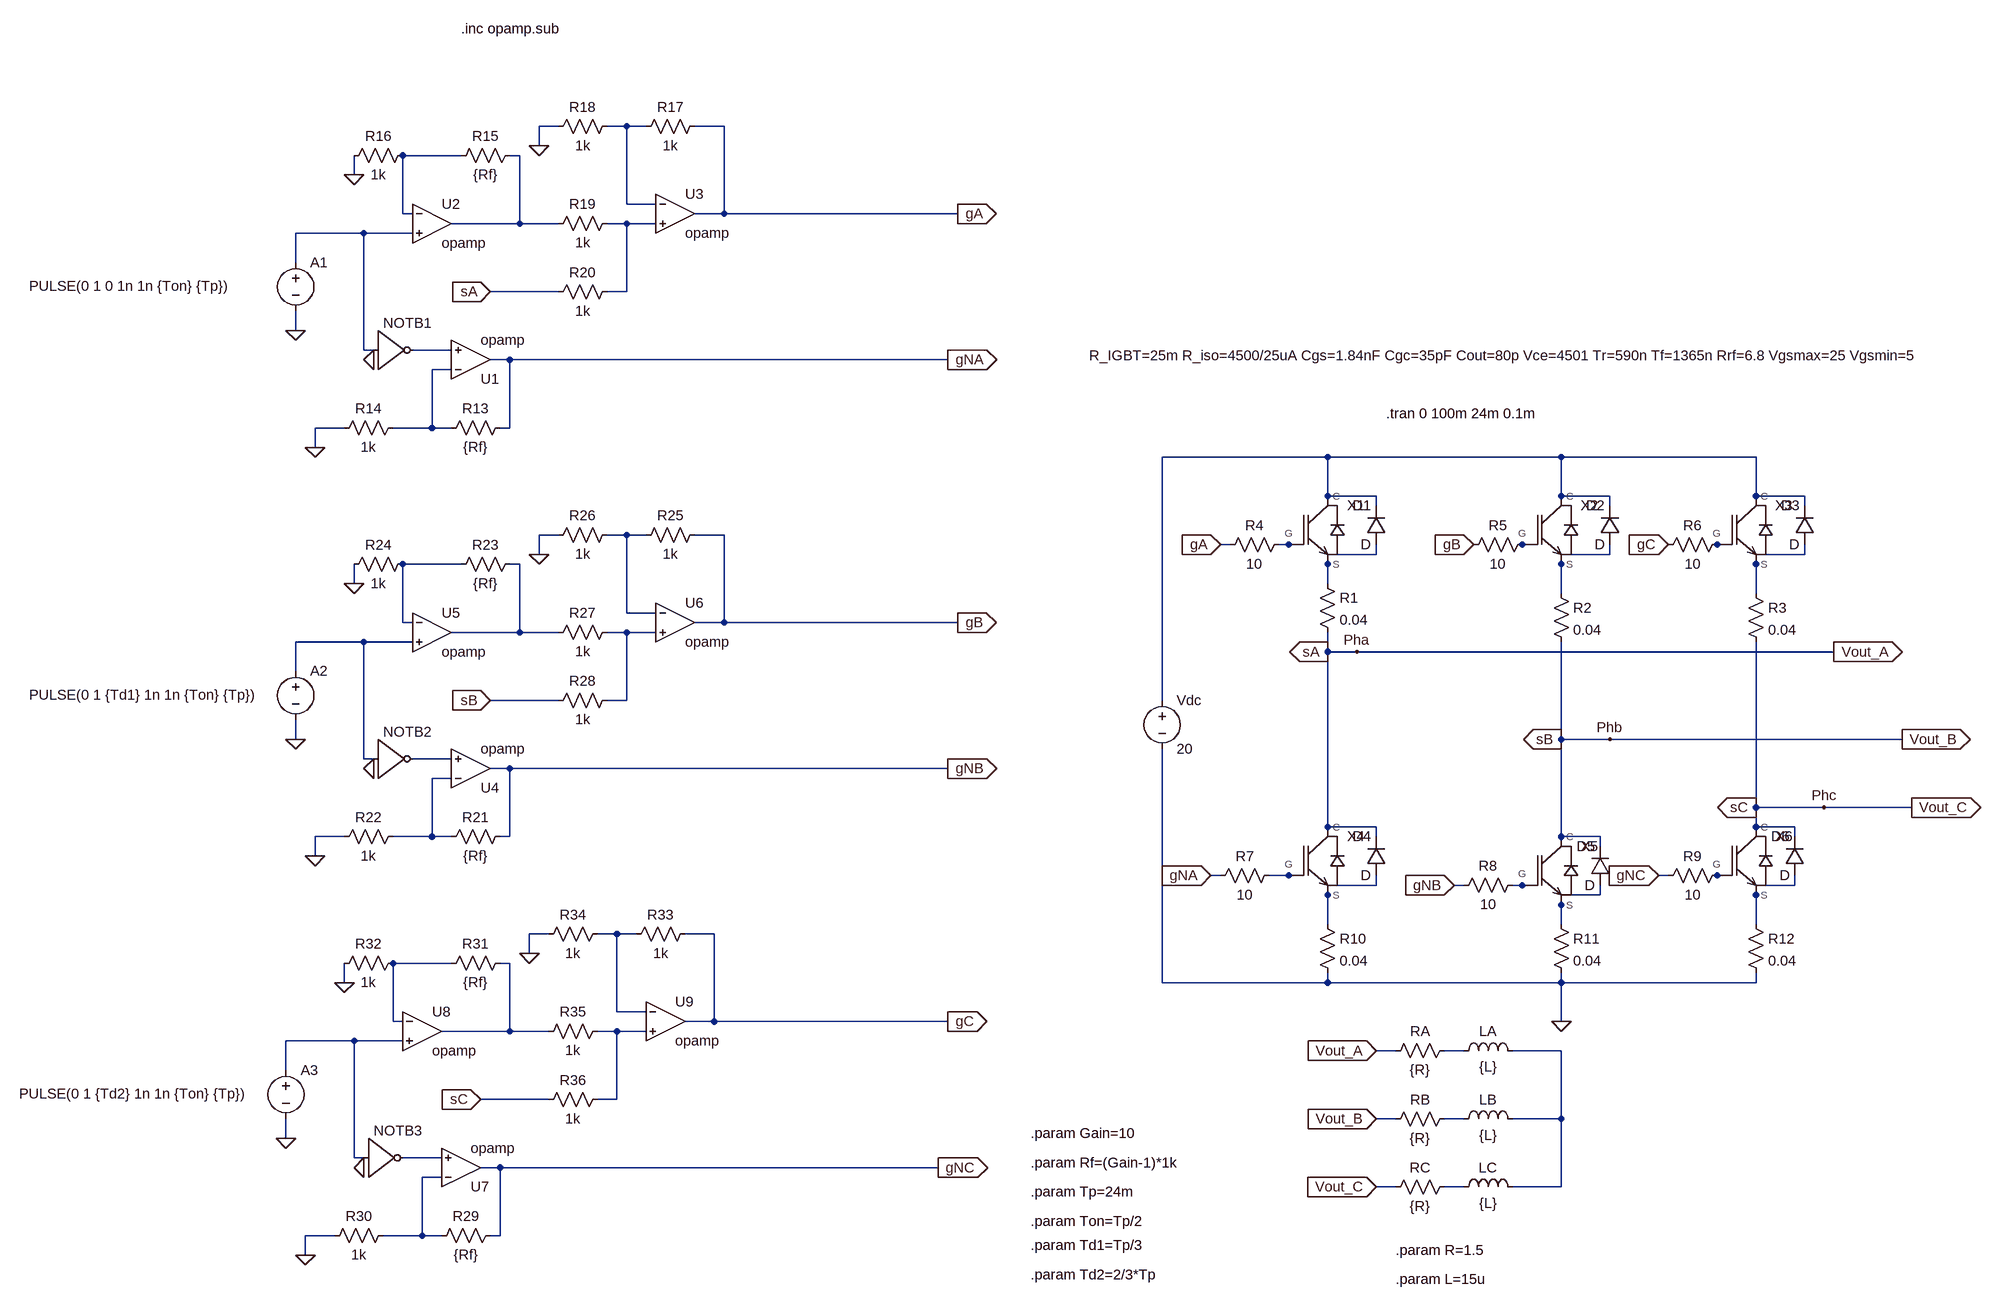
[diagram p0: schematic ServoAmplifier-IGBT_configuration-IXYT.asc]
ServoAmplifier-IGBT_configuration-IXYT.asc, the LTspice schematic file:
Version 4
SHEET 1 3328 1812
WIRE -1744 -1216 -1776 -1216
WIRE -1632 -1216 -1664 -1216
WIRE -1600 -1216 -1632 -1216
WIRE -1472 -1216 -1520 -1216
WIRE -1776 -1184 -1776 -1216
WIRE -1904 -1168 -2000 -1168
WIRE -1808 -1168 -1824 -1168
WIRE -2080 -1136 -2080 -1168
WIRE -1632 -1088 -1632 -1216
WIRE -1584 -1088 -1632 -1088
WIRE -2000 -1072 -2000 -1168
WIRE -1984 -1072 -2000 -1072
WIRE -1472 -1072 -1472 -1216
WIRE -1472 -1072 -1520 -1072
WIRE -1088 -1072 -1472 -1072
WIRE -1808 -1056 -1808 -1168
WIRE -1808 -1056 -1920 -1056
WIRE -1744 -1056 -1808 -1056
WIRE -1632 -1056 -1664 -1056
WIRE -1584 -1056 -1632 -1056
WIRE -2064 -1040 -2176 -1040
WIRE -1984 -1040 -2064 -1040
WIRE -2176 -992 -2176 -1040
WIRE -1744 -944 -1856 -944
WIRE -1632 -944 -1632 -1056
WIRE -1632 -944 -1664 -944
WIRE -2176 -880 -2176 -912
WIRE -2064 -848 -2064 -1040
WIRE -2048 -848 -2064 -848
WIRE -1920 -848 -1984 -848
WIRE -1824 -832 -1856 -832
WIRE -1104 -832 -1824 -832
WIRE -1920 -816 -1952 -816
WIRE -2096 -720 -2144 -720
WIRE -1952 -720 -1952 -816
WIRE -1952 -720 -2016 -720
WIRE -1920 -720 -1952 -720
WIRE -1824 -720 -1824 -832
WIRE -1824 -720 -1840 -720
WIRE -2144 -688 -2144 -720
WIRE -480 -672 -752 -672
WIRE -96 -672 -480 -672
WIRE 224 -672 -96 -672
WIRE -480 -608 -480 -672
WIRE -400 -608 -480 -608
WIRE -96 -608 -96 -672
WIRE -16 -608 -96 -608
WIRE 224 -608 224 -672
WIRE 304 -608 224 -608
WIRE -400 -592 -400 -608
WIRE -16 -592 -16 -608
WIRE 304 -592 304 -608
WIRE -1744 -544 -1776 -544
WIRE -1632 -544 -1664 -544
WIRE -1600 -544 -1632 -544
WIRE -1472 -544 -1520 -544
WIRE -640 -528 -656 -528
WIRE -544 -528 -560 -528
WIRE -528 -528 -544 -528
WIRE -144 -528 -160 -528
WIRE 176 -528 160 -528
WIRE -1776 -512 -1776 -544
WIRE -400 -512 -400 -528
WIRE -400 -512 -480 -512
WIRE -16 -512 -16 -528
WIRE -16 -512 -96 -512
WIRE 304 -512 304 -528
WIRE 304 -512 224 -512
WIRE -1904 -496 -2000 -496
WIRE -1808 -496 -1824 -496
WIRE -480 -496 -480 -512
WIRE -96 -496 -96 -512
WIRE 224 -496 224 -512
WIRE -2080 -464 -2080 -496
WIRE -480 -464 -480 -496
WIRE -96 -448 -96 -496
WIRE 224 -448 224 -496
WIRE -1632 -416 -1632 -544
WIRE -1584 -416 -1632 -416
WIRE -2000 -400 -2000 -496
WIRE -1984 -400 -2000 -400
WIRE -1472 -400 -1472 -544
WIRE -1472 -400 -1520 -400
WIRE -1088 -400 -1472 -400
WIRE -1808 -384 -1808 -496
WIRE -1808 -384 -1920 -384
WIRE -1744 -384 -1808 -384
WIRE -1632 -384 -1664 -384
WIRE -1584 -384 -1632 -384
WIRE -2064 -368 -2176 -368
WIRE -1984 -368 -2064 -368
WIRE -480 -352 -480 -384
WIRE -432 -352 -480 -352
WIRE 352 -352 -432 -352
WIRE -2176 -320 -2176 -368
WIRE -1744 -272 -1856 -272
WIRE -1632 -272 -1632 -384
WIRE -1632 -272 -1664 -272
WIRE -752 -272 -752 -672
WIRE -2176 -208 -2176 -240
WIRE -96 -208 -96 -368
WIRE -16 -208 -96 -208
WIRE 464 -208 -16 -208
WIRE -2064 -176 -2064 -368
WIRE -2048 -176 -2064 -176
WIRE -1920 -176 -1984 -176
WIRE -1824 -160 -1856 -160
WIRE -1104 -160 -1824 -160
WIRE -1920 -144 -1952 -144
WIRE 224 -96 224 -368
WIRE 336 -96 224 -96
WIRE 480 -96 336 -96
WIRE -480 -64 -480 -352
WIRE -400 -64 -480 -64
WIRE 224 -64 224 -96
WIRE 288 -64 224 -64
WIRE -2096 -48 -2144 -48
WIRE -1952 -48 -1952 -144
WIRE -1952 -48 -2016 -48
WIRE -1920 -48 -1952 -48
WIRE -1824 -48 -1824 -160
WIRE -1824 -48 -1840 -48
WIRE -400 -48 -400 -64
WIRE -96 -48 -96 -208
WIRE -32 -48 -96 -48
WIRE 288 -48 288 -64
WIRE -32 -32 -32 -48
WIRE -2144 -16 -2144 -48
WIRE -656 16 -672 16
WIRE -544 16 -576 16
WIRE -528 16 -544 16
WIRE 80 16 64 16
WIRE 176 16 160 16
WIRE -400 32 -400 16
WIRE -400 32 -480 32
WIRE -256 32 -272 32
WIRE -160 32 -176 32
WIRE -144 32 -160 32
WIRE 288 32 288 16
WIRE 288 32 224 32
WIRE -480 48 -480 32
WIRE -32 48 -32 32
WIRE -32 48 -96 48
WIRE 224 48 224 32
WIRE -96 64 -96 48
WIRE -480 96 -480 48
WIRE -96 96 -96 64
WIRE 224 96 224 48
WIRE -1760 112 -1792 112
WIRE -1648 112 -1680 112
WIRE -1616 112 -1648 112
WIRE -1488 112 -1536 112
WIRE -1792 144 -1792 112
WIRE -1920 160 -2016 160
WIRE -1824 160 -1840 160
WIRE -2096 192 -2096 160
WIRE -752 192 -752 -192
WIRE -480 192 -480 176
WIRE -480 192 -752 192
WIRE -96 192 -96 176
WIRE -96 192 -480 192
WIRE 224 192 224 176
WIRE 224 192 -96 192
WIRE -1648 240 -1648 112
WIRE -1600 240 -1648 240
WIRE -2016 256 -2016 160
WIRE -2000 256 -2016 256
WIRE -1488 256 -1488 112
WIRE -1488 256 -1536 256
WIRE -1104 256 -1488 256
WIRE -96 256 -96 192
WIRE -1824 272 -1824 160
WIRE -1824 272 -1936 272
WIRE -1760 272 -1824 272
WIRE -1648 272 -1680 272
WIRE -1600 272 -1648 272
WIRE -2080 288 -2192 288
WIRE -2000 288 -2080 288
WIRE -368 304 -400 304
WIRE -256 304 -288 304
WIRE -96 304 -176 304
WIRE -2192 336 -2192 288
WIRE -1760 384 -1872 384
WIRE -1648 384 -1648 272
WIRE -1648 384 -1680 384
WIRE -368 416 -400 416
WIRE -256 416 -288 416
WIRE -96 416 -96 304
WIRE -96 416 -176 416
WIRE -2192 448 -2192 416
WIRE -2080 480 -2080 288
WIRE -2064 480 -2080 480
WIRE -1936 480 -2000 480
WIRE -1840 496 -1872 496
WIRE -1120 496 -1840 496
WIRE -1936 512 -1968 512
WIRE -368 528 -400 528
WIRE -256 528 -288 528
WIRE -96 528 -96 416
WIRE -96 528 -176 528
WIRE -2112 608 -2160 608
WIRE -1968 608 -1968 512
WIRE -1968 608 -2032 608
WIRE -1936 608 -1968 608
WIRE -1840 608 -1840 496
WIRE -1840 608 -1856 608
WIRE -2160 640 -2160 608
FLAG -96 256 0
FLAG -432 -352 Pha
FLAG -16 -208 Phb
FLAG 336 -96 Phc
FLAG -672 16 gNA
IOPIN -672 16 In
FLAG -656 -528 gA
IOPIN -656 -528 In
FLAG -240 -528 gB
IOPIN -240 -528 In
FLAG 80 -528 gC
IOPIN 80 -528 In
FLAG -272 32 gNB
IOPIN -272 32 In
FLAG 64 16 gNC
IOPIN 64 16 In
FLAG -400 304 Vout_A
IOPIN -400 304 In
FLAG -400 416 Vout_B
IOPIN -400 416 In
FLAG -400 528 Vout_C
IOPIN -400 528 In
FLAG 352 -352 Vout_A
IOPIN 352 -352 Out
FLAG 464 -208 Vout_B
IOPIN 464 -208 Out
FLAG 480 -96 Vout_C
IOPIN 480 -96 Out
FLAG -480 -352 sA
IOPIN -480 -352 Out
FLAG -96 -208 sB
IOPIN -96 -208 Out
FLAG 224 -96 sC
IOPIN 224 -96 Out
FLAG -1088 -1072 gA
IOPIN -1088 -1072 Out
FLAG -1104 -832 gNA
IOPIN -1104 -832 Out
FLAG -2176 -880 0
FLAG -2048 -832 0
FLAG -2144 -688 0
FLAG -2080 -1136 0
FLAG -1856 -944 sA
IOPIN -1856 -944 In
FLAG -1776 -1184 0
FLAG -1088 -400 gB
IOPIN -1088 -400 Out
FLAG -1104 -160 gNB
IOPIN -1104 -160 Out
FLAG -2176 -208 0
FLAG -2048 -160 0
FLAG -2144 -16 0
FLAG -2080 -464 0
FLAG -1856 -272 sB
IOPIN -1856 -272 In
FLAG -1776 -512 0
FLAG -1104 256 gC
IOPIN -1104 256 Out
FLAG -1120 496 gNC
IOPIN -1120 496 Out
FLAG -2192 448 0
FLAG -2064 496 0
FLAG -2160 640 0
FLAG -2096 192 0
FLAG -1872 384 sC
IOPIN -1872 384 In
FLAG -1792 144 0
SYMBOL voltage -752 -288 R0
WINDOW 123 0 0 Left 0
WINDOW 39 0 0 Left 0
SYMATTR InstName Vdc
SYMATTR Value 20
SYMBOL ind -272 320 R270
WINDOW 0 32 56 VTop 2
WINDOW 3 5 56 VBottom 2
SYMATTR InstName LA
SYMATTR Value {L}
SYMBOL ind -272 432 R270
WINDOW 0 32 56 VTop 2
WINDOW 3 5 56 VBottom 2
SYMATTR InstName LB
SYMATTR Value {L}
SYMBOL ind -272 544 R270
WINDOW 0 32 56 VTop 2
WINDOW 3 5 56 VBottom 2
SYMATTR InstName LC
SYMATTR Value {L}
SYMBOL res -384 320 R270
WINDOW 0 32 56 VTop 2
WINDOW 3 0 56 VBottom 2
SYMATTR InstName RA
SYMATTR Value {R}
SYMBOL res -384 432 R270
WINDOW 0 32 56 VTop 2
WINDOW 3 0 56 VBottom 2
SYMATTR InstName RB
SYMATTR Value {R}
SYMBOL res -384 544 R270
WINDOW 0 32 56 VTop 2
WINDOW 3 0 56 VBottom 2
SYMATTR InstName RC
SYMATTR Value {R}
SYMBOL IGBT_model -512 -512 R0
WINDOW 39 -360 -327 Left 2
SYMATTR SpiceLine R_IGBT=25m R_iso=4500/25uA Cgs=1.84nF Cgc=35pF Cout=80p Vce=4501 Tr=590n Tf=1365n Rrf=6.8 Vgsmax=25 Vgsmin=5
SYMATTR InstName X1
SYMBOL IGBT_model -128 -512 R0
SYMATTR SpiceLine R_IGBT=25m R_iso=4500/25uA Cgs=1.84nF Cgc=35pF Cout=80p Vce=4501 Tr=590n Tf=1365n Rrf=6.8 Vgsmax=25 Vgsmin=5
SYMATTR InstName X2
SYMBOL IGBT_model 192 -512 R0
SYMATTR SpiceLine R_IGBT=25m R_iso=4500/25uA Cgs=1.84nF Cgc=35pF Cout=80p Vce=4501 Tr=590n Tf=1365n Rrf=6.8 Vgsmax=25 Vgsmin=5
SYMATTR InstName X3
SYMBOL IGBT_model -512 32 R0
SYMATTR SpiceLine R_IGBT=25m R_iso=4500/25uA Cgs=1.84nF Cgc=35pF Cout=80p Vce=4501 Tr=590n Tf=1365n Rrf=6.8 Vgsmax=25 Vgsmin=5
SYMATTR InstName X4
SYMBOL IGBT_model -128 48 R0
SYMATTR SpiceLine R_IGBT=25m R_iso=4500/25uA Cgs=1.84nF Cgc=35pF Cout=80p Vce=4501 Tr=590n Tf=1365n Rrf=6.8 Vgsmax=25 Vgsmin=5
SYMATTR InstName X5
SYMBOL IGBT_model 192 32 R0
SYMATTR SpiceLine R_IGBT=25m R_iso=4500/25uA Cgs=1.84nF Cgc=35pF Cout=80p Vce=4501 Tr=590n Tf=1365n Rrf=6.8 Vgsmax=25 Vgsmin=5
SYMATTR InstName X6
SYMBOL res -496 -480 R0
SYMATTR InstName R1
SYMATTR Value 0.04
SYMBOL res -112 -464 R0
SYMATTR InstName R2
SYMATTR Value 0.04
SYMBOL res 208 -464 R0
SYMATTR InstName R3
SYMATTR Value 0.04
SYMBOL res -544 -544 R90
WINDOW 0 0 56 VBottom 2
WINDOW 3 32 56 VTop 2
SYMATTR InstName R4
SYMATTR Value 10
SYMBOL res -144 -544 R90
WINDOW 0 0 56 VBottom 2
WINDOW 3 32 56 VTop 2
SYMATTR InstName R5
SYMATTR Value 10
SYMBOL res 176 -544 R90
WINDOW 0 0 56 VBottom 2
WINDOW 3 32 56 VTop 2
SYMATTR InstName R6
SYMATTR Value 10
SYMBOL res -560 0 R90
WINDOW 0 0 56 VBottom 2
WINDOW 3 32 56 VTop 2
SYMATTR InstName R7
SYMATTR Value 10
SYMBOL res -160 16 R90
WINDOW 0 0 56 VBottom 2
WINDOW 3 32 56 VTop 2
SYMATTR InstName R8
SYMATTR Value 10
SYMBOL res 176 0 R90
WINDOW 0 0 56 VBottom 2
WINDOW 3 32 56 VTop 2
SYMATTR InstName R9
SYMATTR Value 10
SYMBOL res -496 80 R0
SYMATTR InstName R10
SYMATTR Value 0.04
SYMBOL res -112 80 R0
SYMATTR InstName R11
SYMATTR Value 0.04
SYMBOL res 208 80 R0
SYMATTR InstName R12
SYMATTR Value 0.04
SYMBOL voltage -2176 -1008 R0
WINDOW 3 -438 55 Left 2
WINDOW 123 0 0 Left 0
WINDOW 39 0 0 Left 0
SYMATTR Value PULSE(0 1 0 1n 1n {Ton} {Tp})
SYMATTR InstName A1
SYMBOL Digital\\inv -2048 -912 R0
WINDOW 0 16 20 Left 2
SYMATTR InstName NOTB1
SYMBOL OpAmps\\opamp -1888 -768 M180
SYMATTR InstName U1
SYMBOL res -1824 -736 R90
WINDOW 0 0 56 VBottom 2
WINDOW 3 32 56 VTop 2
SYMATTR InstName R13
SYMATTR Value {Rf}
SYMBOL res -2112 -704 R270
WINDOW 0 32 56 VTop 2
WINDOW 3 0 56 VBottom 2
SYMATTR InstName R14
SYMATTR Value 1k
SYMBOL res -1808 -1184 R90
WINDOW 0 0 56 VBottom 2
WINDOW 3 32 56 VTop 2
SYMATTR InstName R15
SYMATTR Value {Rf}
SYMBOL res -2096 -1152 R270
WINDOW 0 32 56 VTop 2
WINDOW 3 0 56 VBottom 2
SYMATTR InstName R16
SYMATTR Value 1k
SYMBOL OpAmps\\opamp -1952 -1120 R0
SYMATTR InstName U2
SYMBOL OpAmps\\opamp -1552 -1136 R0
SYMATTR InstName U3
SYMBOL res -1504 -1232 R90
WINDOW 0 0 56 VBottom 2
WINDOW 3 32 56 VTop 2
SYMATTR InstName R17
SYMATTR Value 1k
SYMBOL res -1648 -1232 R90
WINDOW 0 0 56 VBottom 2
WINDOW 3 32 56 VTop 2
SYMATTR InstName R18
SYMATTR Value 1k
SYMBOL res -1648 -1072 R90
WINDOW 0 0 56 VBottom 2
WINDOW 3 32 56 VTop 2
SYMATTR InstName R19
SYMATTR Value 1k
SYMBOL res -1648 -960 R90
WINDOW 0 0 56 VBottom 2
WINDOW 3 32 56 VTop 2
SYMATTR InstName R20
SYMATTR Value 1k
SYMBOL voltage -2176 -336 R0
WINDOW 3 -438 55 Left 2
WINDOW 123 0 0 Left 0
WINDOW 39 0 0 Left 0
SYMATTR Value PULSE(0 1 {Td1} 1n 1n {Ton} {Tp})
SYMATTR InstName A2
SYMBOL Digital\\inv -2048 -240 R0
WINDOW 0 16 20 Left 2
SYMATTR InstName NOTB2
SYMBOL OpAmps\\opamp -1888 -96 M180
SYMATTR InstName U4
SYMBOL res -1824 -64 R90
WINDOW 0 0 56 VBottom 2
WINDOW 3 32 56 VTop 2
SYMATTR InstName R21
SYMATTR Value {Rf}
SYMBOL res -2112 -32 R270
WINDOW 0 32 56 VTop 2
WINDOW 3 0 56 VBottom 2
SYMATTR InstName R22
SYMATTR Value 1k
SYMBOL res -1808 -512 R90
WINDOW 0 0 56 VBottom 2
WINDOW 3 32 56 VTop 2
SYMATTR InstName R23
SYMATTR Value {Rf}
SYMBOL res -2096 -480 R270
WINDOW 0 32 56 VTop 2
WINDOW 3 0 56 VBottom 2
SYMATTR InstName R24
SYMATTR Value 1k
SYMBOL OpAmps\\opamp -1952 -448 R0
SYMATTR InstName U5
SYMBOL OpAmps\\opamp -1552 -464 R0
SYMATTR InstName U6
SYMBOL res -1504 -560 R90
WINDOW 0 0 56 VBottom 2
WINDOW 3 32 56 VTop 2
SYMATTR InstName R25
SYMATTR Value 1k
SYMBOL res -1648 -560 R90
WINDOW 0 0 56 VBottom 2
WINDOW 3 32 56 VTop 2
SYMATTR InstName R26
SYMATTR Value 1k
SYMBOL res -1648 -400 R90
WINDOW 0 0 56 VBottom 2
WINDOW 3 32 56 VTop 2
SYMATTR InstName R27
SYMATTR Value 1k
SYMBOL res -1648 -288 R90
WINDOW 0 0 56 VBottom 2
WINDOW 3 32 56 VTop 2
SYMATTR InstName R28
SYMATTR Value 1k
SYMBOL voltage -2192 320 R0
WINDOW 3 -438 55 Left 2
WINDOW 123 0 0 Left 0
WINDOW 39 0 0 Left 0
SYMATTR Value PULSE(0 1 {Td2} 1n 1n {Ton} {Tp})
SYMATTR InstName A3
SYMBOL Digital\\inv -2064 416 R0
WINDOW 0 16 20 Left 2
SYMATTR InstName NOTB3
SYMBOL OpAmps\\opamp -1904 560 M180
SYMATTR InstName U7
SYMBOL res -1840 592 R90
WINDOW 0 0 56 VBottom 2
WINDOW 3 32 56 VTop 2
SYMATTR InstName R29
SYMATTR Value {Rf}
SYMBOL res -2128 624 R270
WINDOW 0 32 56 VTop 2
WINDOW 3 0 56 VBottom 2
SYMATTR InstName R30
SYMATTR Value 1k
SYMBOL res -1824 144 R90
WINDOW 0 0 56 VBottom 2
WINDOW 3 32 56 VTop 2
SYMATTR InstName R31
SYMATTR Value {Rf}
SYMBOL res -2112 176 R270
WINDOW 0 32 56 VTop 2
WINDOW 3 0 56 VBottom 2
SYMATTR InstName R32
SYMATTR Value 1k
SYMBOL OpAmps\\opamp -1968 208 R0
SYMATTR InstName U8
SYMBOL OpAmps\\opamp -1568 192 R0
SYMATTR InstName U9
SYMBOL res -1520 96 R90
WINDOW 0 0 56 VBottom 2
WINDOW 3 32 56 VTop 2
SYMATTR InstName R33
SYMATTR Value 1k
SYMBOL res -1664 96 R90
WINDOW 0 0 56 VBottom 2
WINDOW 3 32 56 VTop 2
SYMATTR InstName R34
SYMATTR Value 1k
SYMBOL res -1664 256 R90
WINDOW 0 0 56 VBottom 2
WINDOW 3 32 56 VTop 2
SYMATTR InstName R35
SYMATTR Value 1k
SYMBOL res -1664 368 R90
WINDOW 0 0 56 VBottom 2
WINDOW 3 32 56 VTop 2
SYMATTR InstName R36
SYMATTR Value 1k
SYMBOL diode -384 -528 R180
WINDOW 0 24 64 Left 2
WINDOW 3 24 0 Left 2
SYMATTR InstName D1
SYMBOL diode 0 -528 R180
WINDOW 0 24 64 Left 2
WINDOW 3 24 0 Left 2
SYMATTR InstName D2
SYMBOL diode 320 -528 R180
WINDOW 0 24 64 Left 2
WINDOW 3 24 0 Left 2
SYMATTR InstName D3
SYMBOL diode -384 16 R180
WINDOW 0 24 64 Left 2
WINDOW 3 24 0 Left 2
SYMATTR InstName D4
SYMBOL diode -16 32 R180
WINDOW 0 24 64 Left 2
WINDOW 3 24 0 Left 2
SYMATTR InstName D5
SYMBOL diode 304 16 R180
WINDOW 0 24 64 Left 2
WINDOW 3 24 0 Left 2
SYMATTR InstName D6
TEXT -384 -744 Left 2 !.tran 0 100m 24m 0.1m
TEXT -368 632 Left 2 !.param R=1.5
TEXT -368 680 Left 2 !.param L=15u
TEXT -968 488 Left 2 !.param Rf=(Gain-1)*1k
TEXT -968 536 Left 2 !.param Tp=24m
TEXT -968 584 Left 2 !.param Ton=Tp/2
TEXT -968 624 Left 2 !.param Td1=Tp/3
TEXT -968 672 Left 2 !.param Td2=2/3*Tp
TEXT -968 440 Left 2 !.param Gain=10
TEXT -1904 -1376 Left 2 !.inc opamp.sub

The netlist it stands for:
* ServoAmplifier-IGBT_configuration-IXYT.asc
Vdc N008 0 20
LA N033 N034 {L}
LB N035 N034 {L}
LC N038 N034 {L}
RA sA N033 {R}
RB sB N035 {R}
RC sC N038 {R}
XX1 N008 N010 N013 IGBT_model params: R_IGBT=25m R_iso=4500/25uA Cgs=1.84nF Cgc=35pF Cout=80p Vce=4501 Tr=590n Tf=1365n Rrf=6.8 Vgsmax=25 Vgsmin=5  ; pins C G S
XX2 N008 N011 N014 IGBT_model params: R_IGBT=25m R_iso=4500/25uA Cgs=1.84nF Cgc=35pF Cout=80p Vce=4501 Tr=590n Tf=1365n Rrf=6.8 Vgsmax=25 Vgsmin=5  ; pins C G S
XX3 N008 N012 N015 IGBT_model params: R_IGBT=25m R_iso=4500/25uA Cgs=1.84nF Cgc=35pF Cout=80p Vce=4501 Tr=590n Tf=1365n Rrf=6.8 Vgsmax=25 Vgsmin=5  ; pins C G S
XX4 sA N022 N024 IGBT_model params: R_IGBT=25m R_iso=4500/25uA Cgs=1.84nF Cgc=35pF Cout=80p Vce=4501 Tr=590n Tf=1365n Rrf=6.8 Vgsmax=25 Vgsmin=5  ; pins C G S
XX5 sB N025 N027 IGBT_model params: R_IGBT=25m R_iso=4500/25uA Cgs=1.84nF Cgc=35pF Cout=80p Vce=4501 Tr=590n Tf=1365n Rrf=6.8 Vgsmax=25 Vgsmin=5  ; pins C G S
XX6 sC N023 N026 IGBT_model params: R_IGBT=25m R_iso=4500/25uA Cgs=1.84nF Cgc=35pF Cout=80p Vce=4501 Tr=590n Tf=1365n Rrf=6.8 Vgsmax=25 Vgsmin=5  ; pins C G S
R1 N013 sA 0.04
R2 N014 sB 0.04
R3 N015 sC 0.04
R4 N010 gA 10
R5 N011 gB 10
R6 N012 gC 10
R7 N022 gNA 10
R8 N025 gNB 10
R9 N023 gNC 10
R10 N024 0 0.04
R11 N027 0 0.04
R12 N026 0 0.04
V§A1 N005 0 PULSE(0 1 0 1n 1n {Ton} {Tp})
A§NOTB1 N005 0 0 0 0 N006 0 0 BUF
XU1 N007 N006 gNA opamp Aol=100K GBW=10Meg  ; pins invin noninvin out
R13 gNA N007 {Rf}
R14 0 N007 1k
R15 N003 N002 {Rf}
R16 0 N002 1k
XU2 N002 N005 N003 opamp Aol=100K GBW=10Meg  ; pins invin noninvin out
XU3 N001 N004 gA opamp Aol=100K GBW=10Meg  ; pins invin noninvin out
R17 gA N001 1k
R18 N001 0 1k
R19 N004 N003 1k
R20 N004 sA 1k
V§A2 N019 0 PULSE(0 1 {Td1} 1n 1n {Ton} {Tp})
A§NOTB2 N019 0 0 0 0 N020 0 0 BUF
XU4 N021 N020 gNB opamp Aol=100K GBW=10Meg  ; pins invin noninvin out
R21 gNB N021 {Rf}
R22 0 N021 1k
R23 N017 N016 {Rf}
R24 0 N016 1k
XU5 N016 N019 N017 opamp Aol=100K GBW=10Meg  ; pins invin noninvin out
XU6 N009 N018 gB opamp Aol=100K GBW=10Meg  ; pins invin noninvin out
R25 gB N009 1k
R26 N009 0 1k
R27 N018 N017 1k
R28 N018 sB 1k
V§A3 N032 0 PULSE(0 1 {Td2} 1n 1n {Ton} {Tp})
A§NOTB3 N032 0 0 0 0 N036 0 0 BUF
XU7 N037 N036 gNC opamp Aol=100K GBW=10Meg  ; pins invin noninvin out
R29 gNC N037 {Rf}
R30 0 N037 1k
R31 N030 N029 {Rf}
R32 0 N029 1k
XU8 N029 N032 N030 opamp Aol=100K GBW=10Meg  ; pins invin noninvin out
XU9 N028 N031 gC opamp Aol=100K GBW=10Meg  ; pins invin noninvin out
R33 gC N028 1k
R34 N028 0 1k
R35 N031 N030 1k
R36 N031 sC 1k
D1 N013 N008 D
D2 N014 N008 D
D3 N015 N008 D
D4 N024 sA D
D5 N027 sB D
D6 N026 sC D
.model D D
.lib standard.dio
.tran 0 100m 24m 0.1m
.param R=1.5
.param L=15u
.param Rf=(Gain-1)*1k
.param Tp=24m
.param Ton=Tp/2
.param Td1=Tp/3
.param Td2=2/3*Tp
.param Gain=10
.inc opamp.sub
.backanno
.end